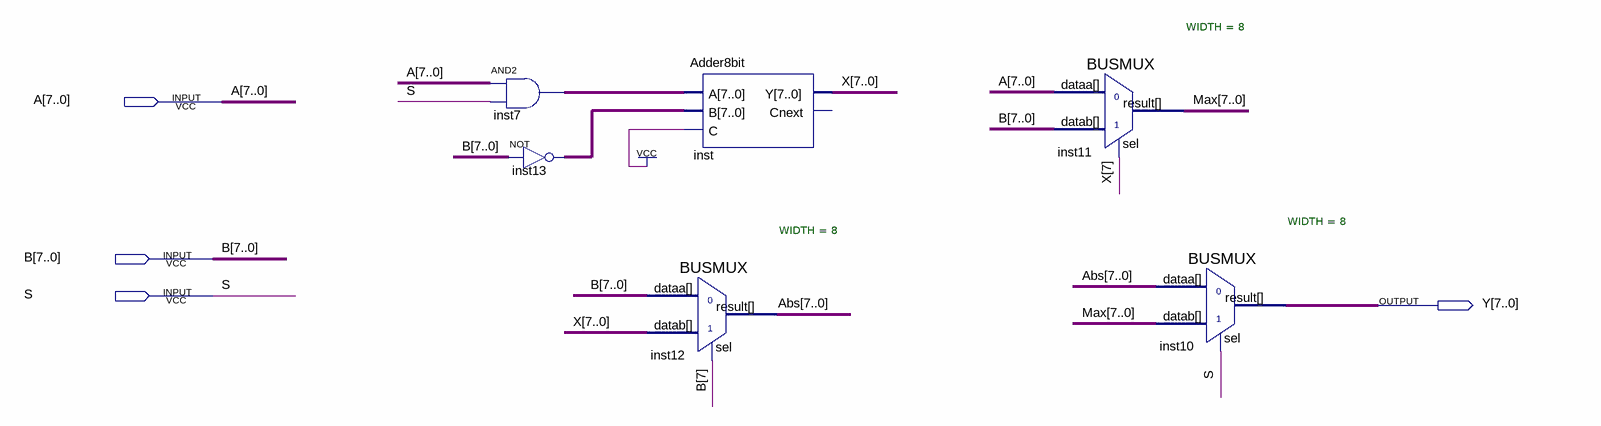
[diagram p0: schematic sheet]
// Quartus schematic AddMax.bdf as structural Verilog: 6 symbols, 4 pins
module AddMax (
  input  [7:0] A,
  input  [7:0] B,
  input  S,
  output [7:0] Y
);

  wire [7:0] Abs, inst7_out, inst13_out, Max, X;

  assign inst7_out = A & {8{S}};  // AND2 inst7, 8 bits wide
  assign inst13_out = ~B;  // NOT inst13, 8 bits wide
  Adder8bit inst (.A(inst7_out), .B(inst13_out), .C(1'b1), .Y(X));  // open: Cnext
  BUSMUX #(.WIDTH(8)) inst12 (.datab(X), .sel(B[7]), .dataa(B), .result(Abs));
  BUSMUX #(.WIDTH(8)) inst11 (.datab(B), .sel(X[7]), .dataa(A), .result(Max));
  BUSMUX #(.WIDTH(8)) inst10 (.datab(Max), .sel(S), .dataa(Abs), .result(Y));
endmodule
